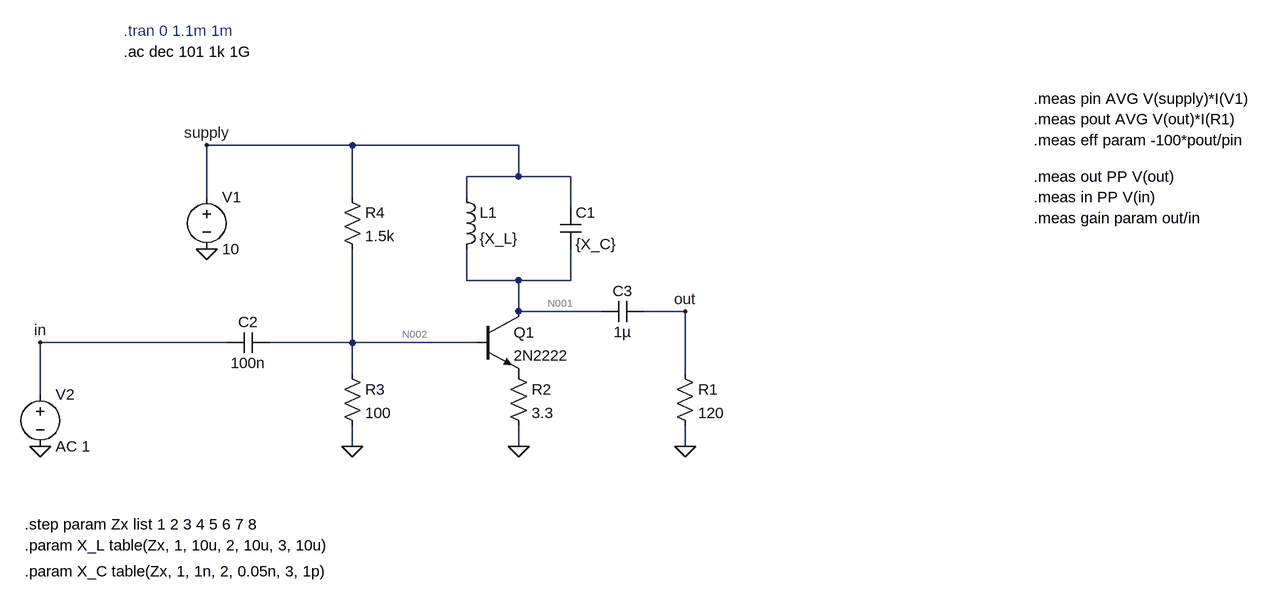
[diagram p0: schematic class-B-2n2222-220MHz.asc]
class-B-2n2222-220MHz.asc, the LTspice schematic file:
Version 4
SHEET 1 2644 1396
WIRE -256 -368 -480 -368
WIRE 0 -368 -256 -368
WIRE 0 -320 0 -368
WIRE 0 -320 -80 -320
WIRE 80 -320 0 -320
WIRE -480 -288 -480 -368
WIRE -256 -288 -256 -368
WIRE -80 -288 -80 -320
WIRE 80 -272 80 -320
WIRE -80 -160 -80 -208
WIRE 0 -160 -80 -160
WIRE 80 -160 80 -208
WIRE 80 -160 0 -160
WIRE 0 -112 0 -160
WIRE 128 -112 0 -112
WIRE 256 -112 192 -112
WIRE -448 -64 -736 -64
WIRE -256 -64 -256 -208
WIRE -256 -64 -384 -64
WIRE -64 -64 -256 -64
WIRE -256 -16 -256 -64
WIRE 256 -16 256 -112
WIRE -736 16 -736 -64
WIRE -256 96 -256 64
WIRE 0 96 0 64
WIRE 256 96 256 64
FLAG -736 96 0
FLAG -256 96 0
FLAG 0 96 0
FLAG 256 96 0
FLAG -480 -208 0
FLAG -736 -64 in
FLAG 256 -112 out
FLAG -480 -368 supply
SYMBOL voltage -736 0 R0
WINDOW 123 0 0 Left 0
WINDOW 39 0 0 Left 0
SYMATTR InstName V2
SYMATTR Value AC 1
SYMBOL voltage -480 -304 R0
WINDOW 123 0 0 Left 0
WINDOW 39 0 0 Left 0
SYMATTR InstName V1
SYMATTR Value 10
SYMBOL res 240 -32 R0
SYMATTR InstName R1
SYMATTR Value 120
SYMBOL res -16 -32 R0
SYMATTR InstName R2
SYMATTR Value 3.3
SYMBOL res -272 -32 R0
SYMATTR InstName R3
SYMATTR Value 100
SYMBOL res -272 -304 R0
SYMATTR InstName R4
SYMATTR Value 1.5k
SYMBOL ind -96 -304 R0
SYMATTR InstName L1
SYMATTR Value {X_L}
SYMBOL cap 64 -272 R0
SYMATTR InstName C1
SYMATTR Value {X_C}
SYMBOL cap -384 -80 R90
WINDOW 0 0 32 VBottom 2
WINDOW 3 32 32 VTop 2
SYMATTR InstName C2
SYMATTR Value 100n
SYMBOL cap 192 -128 R90
WINDOW 0 0 32 VBottom 2
WINDOW 3 32 32 VTop 2
SYMATTR InstName C3
SYMATTR Value 1µ
SYMBOL npn -64 -112 R0
SYMATTR InstName Q1
SYMATTR Value 2N2222
TEXT -608 -544 Left 2 ;.tran 0 1.1m 1m
TEXT 792 -440 Left 2 !.meas pin AVG V(supply)*I(V1)
TEXT 792 -408 Left 2 !.meas pout AVG V(out)*I(R1)
TEXT 792 -376 Left 2 !.meas eff param -100*pout/pin
TEXT 792 -320 Left 2 !.meas out PP V(out)
TEXT 792 -288 Left 2 !.meas in PP V(in)
TEXT 792 -256 Left 2 !.meas gain param out/in
TEXT -760 248 Left 2 !.param X_L table(Zx, 1, 10u, 2, 10u, 3, 10u)
TEXT -608 -512 Left 2 !.ac dec 101 1k 1G
TEXT -760 288 Left 2 !.param X_C table(Zx, 1, 1n, 2, 0.05n, 3, 1p)
TEXT -760 216 Left 2 !.step param Zx list 1 2 3 4 5 6 7 8

The netlist it stands for:
* class-B-2n2222-220MHz.asc
V2 in 0 AC 1
V1 supply 0 10
R1 out 0 120
R2 P001 0 3.3
R3 N002 0 100
R4 supply N002 1.5k
L1 supply N001 {X_L}
C1 supply N001 {X_C}
C2 N002 in 100n
C3 out N001 1µ
Q1 N001 N002 P001 0 2N2222
.model NPN NPN
.model PNP PNP
.lib standard.bjt
* .tran 0 1.1m 1m
.meas pin AVG V(supply)*I(V1)
.meas pout AVG V(out)*I(R1)
.meas eff param -100*pout/pin
.meas out PP V(out)
.meas in PP V(in)
.meas gain param out/in
.param X_L table(Zx, 1, 10u, 2, 10u, 3, 10u)
.ac dec 101 1k 1G
.param X_C table(Zx, 1, 1n, 2, 0.05n, 3, 1p)
.step param Zx list 1 2 3 4 5 6 7 8
.backanno
.end

* Results of the author's LTspice run, read from the files saved beside the schematic
* Operating Point (first step), zero values left out:
*   zx = 1 
*   V(supply) = 10 V
*   V(p001) = 1.075 mV
*   V(n002) = 624.9 mV
*   V(n001) = 10 V
*   Ic(Q1) = 324.4 µA
*   Ib(Q1) = 1.484 µA
*   Ie(Q1) = -325.8 µA
*   I(L1) = 324.4 µA
*   I(R2) = 325.8 µA
*   I(R3) = 6.249 mA
*   I(R4) = 6.25 mA
*   I(V1) = -6.574 mA
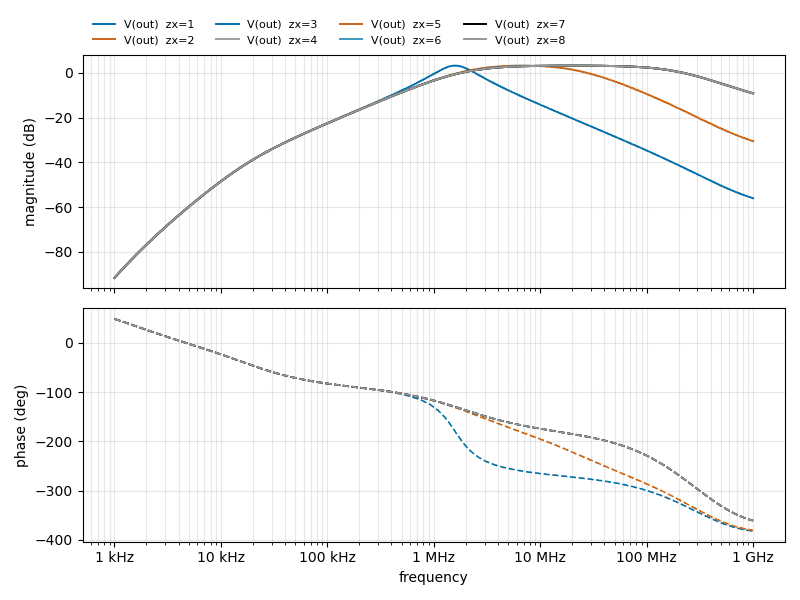
[diagram p1: AC Analysis of class-B-2n2222-220MHz.asc, plotted from the saved traces]
* AC Analysis, 8 runs:
*   V(out) [zx=1]: -91.52 dB at 1 kHz, -56.05 dB at 1 GHz, peak 3.15 dB at 1.578 MHz, 3 dB below the peak at 1.059 MHz and 2.381 MHz
*   V(out) [zx=2]: -91.52 dB at 1 kHz, -30.55 dB at 1 GHz, peak 3.15 dB at 6.787 MHz, 3 dB below the peak at 1.779 MHz and 26.32 MHz
*   V(out) [zx=3]: -91.52 dB at 1 kHz, -9.21 dB at 1 GHz, peak 3.13 dB at 19.82 MHz, 3 dB below the peak at 1.886 MHz and 210.7 MHz
*   V(out) [zx=4]: -91.52 dB at 1 kHz, -9.21 dB at 1 GHz, peak 3.13 dB at 19.82 MHz, 3 dB below the peak at 1.886 MHz and 210.7 MHz
*   V(out) [zx=5]: -91.52 dB at 1 kHz, -9.21 dB at 1 GHz, peak 3.13 dB at 19.82 MHz, 3 dB below the peak at 1.886 MHz and 210.7 MHz
*   V(out) [zx=6]: -91.52 dB at 1 kHz, -9.21 dB at 1 GHz, peak 3.13 dB at 19.82 MHz, 3 dB below the peak at 1.886 MHz and 210.7 MHz
*   V(out) [zx=7]: -91.52 dB at 1 kHz, -9.21 dB at 1 GHz, peak 3.13 dB at 19.82 MHz, 3 dB below the peak at 1.886 MHz and 210.7 MHz
*   V(out) [zx=8]: -91.52 dB at 1 kHz, -9.21 dB at 1 GHz, peak 3.13 dB at 19.82 MHz, 3 dB below the peak at 1.886 MHz and 210.7 MHz
* From the log:
*   Measurement: pin
*     step  AVG(v(supply)*i(v1))  FROM  TO
*        1  0  1000  1e+09
*        2  0  1000  1e+09
*        3  0  1000  1e+09
*        4  0  1000  1e+09
*        5  0  1000  1e+09
*        6  0  1000  1e+09
*        7  0  1000  1e+09
*        8  0  1000  1e+09
*   Measurement: pout
*     step  AVG(v(out)*i(r1))  FROM  TO
*        1  3.56412e-05  1000  1e+09
*        2  0.000634126  1000  1e+09
*        3  0.00503743  1000  1e+09
*        4  0.00503743  1000  1e+09
*        5  0.00503743  1000  1e+09
*        6  0.00503743  1000  1e+09
*        7  0.00503743  1000  1e+09
*        8  0.00503743  1000  1e+09
*   Measurement: eff
*     step  -100*pout/pin
*        1  (-nan(ind)dB,-nan(ind)°)
*        2  (-nan(ind)dB,-nan(ind)°)
*        3  (-nan(ind)dB,-nan(ind)°)
*        4  (-nan(ind)dB,-nan(ind)°)
*        5  (-nan(ind)dB,-nan(ind)°)
*        6  (-nan(ind)dB,-nan(ind)°)
*        7  (-nan(ind)dB,-nan(ind)°)
*        8  (-nan(ind)dB,-nan(ind)°)
*   Measurement: out
*     step  PP(v(out))  FROM  TO
*        1  (94.6718dB,132.36°)  1000  1e+09
*        2  (94.6713dB,129.646°)  1000  1e+09
*        3  (94.653dB,126.514°)  1000  1e+09
*        4  (94.653dB,126.514°)  1000  1e+09
*        5  (94.653dB,126.514°)  1000  1e+09
*        6  (94.653dB,126.514°)  1000  1e+09
*        7  (94.653dB,126.514°)  1000  1e+09
*        8  (94.653dB,126.514°)  1000  1e+09
*   Measurement: in
*     step  PP(v(in))  FROM  TO
*        1  (0dB,0°)  1000  1e+09
*        2  (0dB,0°)  1000  1e+09
*        3  (0dB,0°)  1000  1e+09
*        4  (0dB,0°)  1000  1e+09
*        5  (0dB,0°)  1000  1e+09
*        6  (0dB,0°)  1000  1e+09
*        7  (0dB,0°)  1000  1e+09
*        8  (0dB,0°)  1000  1e+09
*   Measurement: gain
*     step  out/in
*        1  (94.6718dB,132.36°)
*        2  (94.6713dB,129.646°)
*        3  (94.653dB,126.514°)
*        4  (94.653dB,126.514°)
*        5  (94.653dB,126.514°)
*        6  (94.653dB,126.514°)
*        7  (94.653dB,126.514°)
*        8  (94.653dB,126.514°)